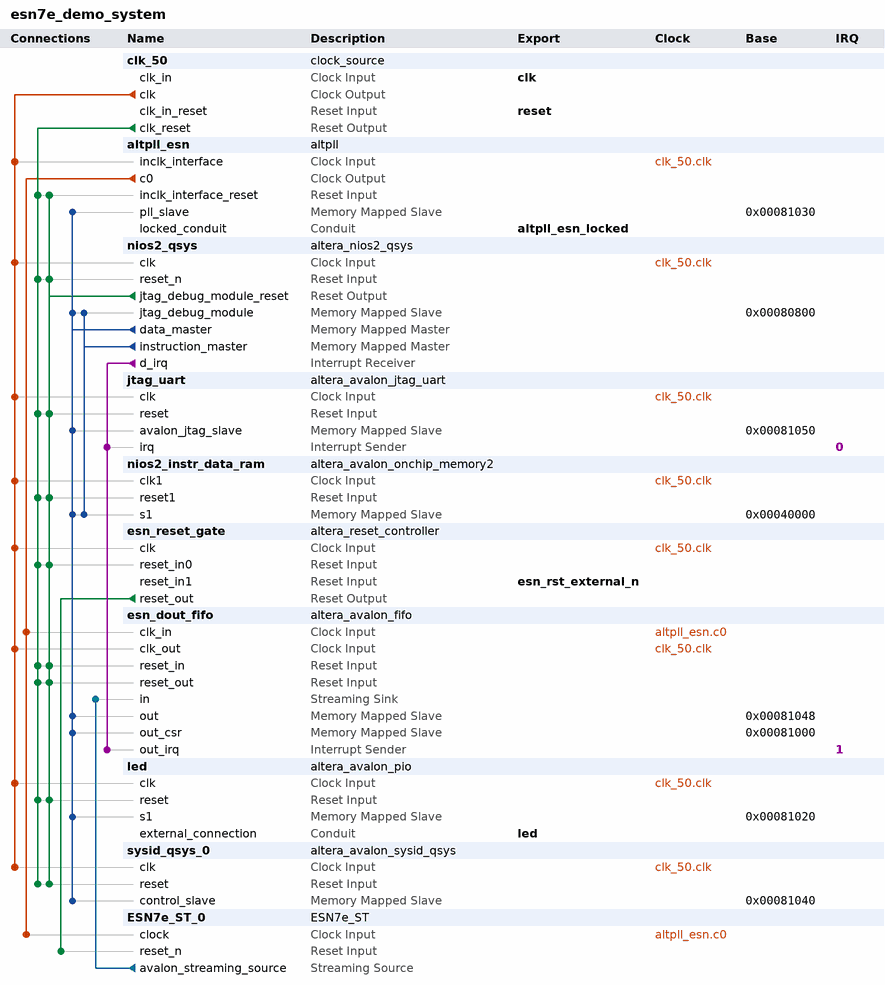
[diagram p0: system contents]
# Platform Designer (Qsys) system esn7e_demo_system, Cyclone IV E EP4CE115F29C7
# Parameters at their usual value, and those the tool derives, are not listed.
package require -exact qsys 13.1
create_system esn7e_demo_system
set_project_property DEVICE_FAMILY {Cyclone IV E}
set_project_property DEVICE EP4CE115F29C7

add_instance clk_50 clock_source 13.1
set_instance_parameter_value clk_50 clockFrequency 50000000

add_instance altpll_esn altpll 13.1
set_instance_parameter_value altpll_esn INCLK0_INPUT_FREQUENCY 20000
set_instance_parameter_value altpll_esn CLK0_MULTIPLY_BY 1
set_instance_parameter_value altpll_esn CLK0_DIVIDE_BY 50
set_instance_parameter_value altpll_esn PORT_clk1 PORT_UNUSED
set_instance_parameter_value altpll_esn PORT_clk2 PORT_UNUSED
set_instance_parameter_value altpll_esn PORT_clk3 PORT_UNUSED
set_instance_parameter_value altpll_esn PORT_ARESET PORT_UNUSED
set_instance_parameter_value altpll_esn PORT_LOCKED PORT_USED

add_instance nios2_qsys altera_nios2_qsys 13.1
set_instance_parameter_value nios2_qsys resetSlave nios2_instr_data_ram.s1
set_instance_parameter_value nios2_qsys mmu_TLBMissExcSlave None
set_instance_parameter_value nios2_qsys exceptionSlave nios2_instr_data_ram.s1
set_instance_parameter_value nios2_qsys breakSlave nios2_qsys.jtag_debug_module
set_instance_parameter_value nios2_qsys impl Fast
set_instance_parameter_value nios2_qsys icache_size 4096

add_instance jtag_uart altera_avalon_jtag_uart 13.1
set_instance_parameter_value jtag_uart simInteractiveOptions NO_INTERACTIVE_WINDOWS

add_instance nios2_instr_data_ram altera_avalon_onchip_memory2 13.1
set_instance_parameter_value nios2_instr_data_ram dataWidth 32
set_instance_parameter_value nios2_instr_data_ram dualPort false
set_instance_parameter_value nios2_instr_data_ram initMemContent true
set_instance_parameter_value nios2_instr_data_ram initializationFileName onchip_mem.hex
set_instance_parameter_value nios2_instr_data_ram memorySize 204800

add_instance esn_reset_gate altera_reset_controller 13.1
set_instance_parameter_value esn_reset_gate NUM_RESET_INPUTS 2
set_instance_parameter_value esn_reset_gate SYNC_DEPTH 2

add_instance esn_dout_fifo altera_avalon_fifo 13.1
set_instance_parameter_value esn_dout_fifo bitsPerSymbol 32
set_instance_parameter_value esn_dout_fifo channelWidth 0
set_instance_parameter_value esn_dout_fifo errorWidth 0
set_instance_parameter_value esn_dout_fifo fifoDepth 2048
set_instance_parameter_value esn_dout_fifo fifoInputInterfaceOptions AVALONST_SINK
set_instance_parameter_value esn_dout_fifo fifoOutputInterfaceOptions AVALONMM_READ
set_instance_parameter_value esn_dout_fifo singleClockMode false
set_instance_parameter_value esn_dout_fifo symbolsPerBeat 1
set_instance_parameter_value esn_dout_fifo useBackpressure false
set_instance_parameter_value esn_dout_fifo useIRQ true
set_instance_parameter_value esn_dout_fifo usePacket false
set_instance_parameter_value esn_dout_fifo useReadControl true
set_instance_parameter_value esn_dout_fifo useWriteControl false

add_instance led altera_avalon_pio 13.1
set_instance_parameter_value led direction Output
set_instance_parameter_value led width 8

add_instance sysid_qsys_0 altera_avalon_sysid_qsys 13.1
set_instance_parameter_value sysid_qsys_0 id 0

add_instance ESN7e_ST_0 ESN7e_ST 1.0

# connections
add_connection altpll_esn.c0 ESN7e_ST_0.clock clock
add_connection altpll_esn.c0 esn_dout_fifo.clk_in clock
add_connection clk_50.clk altpll_esn.inclk_interface clock
add_connection clk_50.clk esn_dout_fifo.clk_out clock
add_connection clk_50.clk esn_reset_gate.clk clock
add_connection clk_50.clk jtag_uart.clk clock
add_connection clk_50.clk led.clk clock
add_connection clk_50.clk nios2_instr_data_ram.clk1 clock
add_connection clk_50.clk nios2_qsys.clk clock
add_connection clk_50.clk sysid_qsys_0.clk clock
add_connection clk_50.clk_reset altpll_esn.inclk_interface_reset reset
add_connection clk_50.clk_reset esn_dout_fifo.reset_in reset
add_connection clk_50.clk_reset esn_dout_fifo.reset_out reset
add_connection clk_50.clk_reset esn_reset_gate.reset_in0 reset
add_connection clk_50.clk_reset jtag_uart.reset reset
add_connection clk_50.clk_reset led.reset reset
add_connection clk_50.clk_reset nios2_instr_data_ram.reset1 reset
add_connection clk_50.clk_reset nios2_qsys.reset_n reset
add_connection clk_50.clk_reset sysid_qsys_0.reset reset
add_connection esn_reset_gate.reset_out ESN7e_ST_0.reset_n reset
add_connection nios2_qsys.jtag_debug_module_reset altpll_esn.inclk_interface_reset reset
add_connection nios2_qsys.jtag_debug_module_reset esn_dout_fifo.reset_in reset
add_connection nios2_qsys.jtag_debug_module_reset esn_dout_fifo.reset_out reset
add_connection nios2_qsys.jtag_debug_module_reset esn_reset_gate.reset_in0 reset
add_connection nios2_qsys.jtag_debug_module_reset jtag_uart.reset reset
add_connection nios2_qsys.jtag_debug_module_reset led.reset reset
add_connection nios2_qsys.jtag_debug_module_reset nios2_instr_data_ram.reset1 reset
add_connection nios2_qsys.jtag_debug_module_reset nios2_qsys.reset_n reset
add_connection nios2_qsys.jtag_debug_module_reset sysid_qsys_0.reset reset
add_connection nios2_qsys.data_master altpll_esn.pll_slave avalon
set_connection_parameter_value nios2_qsys.data_master/altpll_esn.pll_slave baseAddress 0x00081030
add_connection nios2_qsys.data_master esn_dout_fifo.out avalon
set_connection_parameter_value nios2_qsys.data_master/esn_dout_fifo.out baseAddress 0x00081048
add_connection nios2_qsys.data_master esn_dout_fifo.out_csr avalon
set_connection_parameter_value nios2_qsys.data_master/esn_dout_fifo.out_csr baseAddress 0x00081000
add_connection nios2_qsys.data_master jtag_uart.avalon_jtag_slave avalon
set_connection_parameter_value nios2_qsys.data_master/jtag_uart.avalon_jtag_slave baseAddress 0x00081050
add_connection nios2_qsys.data_master led.s1 avalon
set_connection_parameter_value nios2_qsys.data_master/led.s1 baseAddress 0x00081020
add_connection nios2_qsys.data_master nios2_instr_data_ram.s1 avalon
set_connection_parameter_value nios2_qsys.data_master/nios2_instr_data_ram.s1 baseAddress 0x00040000
add_connection nios2_qsys.data_master nios2_qsys.jtag_debug_module avalon
set_connection_parameter_value nios2_qsys.data_master/nios2_qsys.jtag_debug_module baseAddress 0x00080800
add_connection nios2_qsys.data_master sysid_qsys_0.control_slave avalon
set_connection_parameter_value nios2_qsys.data_master/sysid_qsys_0.control_slave baseAddress 0x00081040
add_connection nios2_qsys.instruction_master nios2_instr_data_ram.s1 avalon
set_connection_parameter_value nios2_qsys.instruction_master/nios2_instr_data_ram.s1 baseAddress 0x00040000
add_connection nios2_qsys.instruction_master nios2_qsys.jtag_debug_module avalon
set_connection_parameter_value nios2_qsys.instruction_master/nios2_qsys.jtag_debug_module baseAddress 0x00080800
add_connection ESN7e_ST_0.avalon_streaming_source esn_dout_fifo.in avalon_streaming
add_connection nios2_qsys.d_irq esn_dout_fifo.out_irq interrupt
set_connection_parameter_value nios2_qsys.d_irq/esn_dout_fifo.out_irq irqNumber 1
add_connection nios2_qsys.d_irq jtag_uart.irq interrupt
set_connection_parameter_value nios2_qsys.d_irq/jtag_uart.irq irqNumber 0

# exported interfaces
add_interface clk clock sink
set_interface_property clk EXPORT_OF clk_50.clk_in
add_interface reset reset sink
set_interface_property reset EXPORT_OF clk_50.clk_in_reset
add_interface altpll_esn_locked conduit end
set_interface_property altpll_esn_locked EXPORT_OF altpll_esn.locked_conduit
add_interface esn_rst_external_n reset sink
set_interface_property esn_rst_external_n EXPORT_OF esn_reset_gate.reset_in1
add_interface led conduit end
set_interface_property led EXPORT_OF led.external_connection

set_interconnect_requirement {$system} qsys_mm.clockCrossingAdapter HANDSHAKE
set_interconnect_requirement {$system} qsys_mm.maxAdditionalLatency 1
set_interconnect_requirement {$system} qsys_mm.insertDefaultSlave false

save_system esn7e_demo_system.qsys
